# Altium schematic sheet XMOS_TSBOARD_Xmos.SchDoc
size A3; DocumentNumber: 3; SheetNumber: 3; SheetTotal: 8
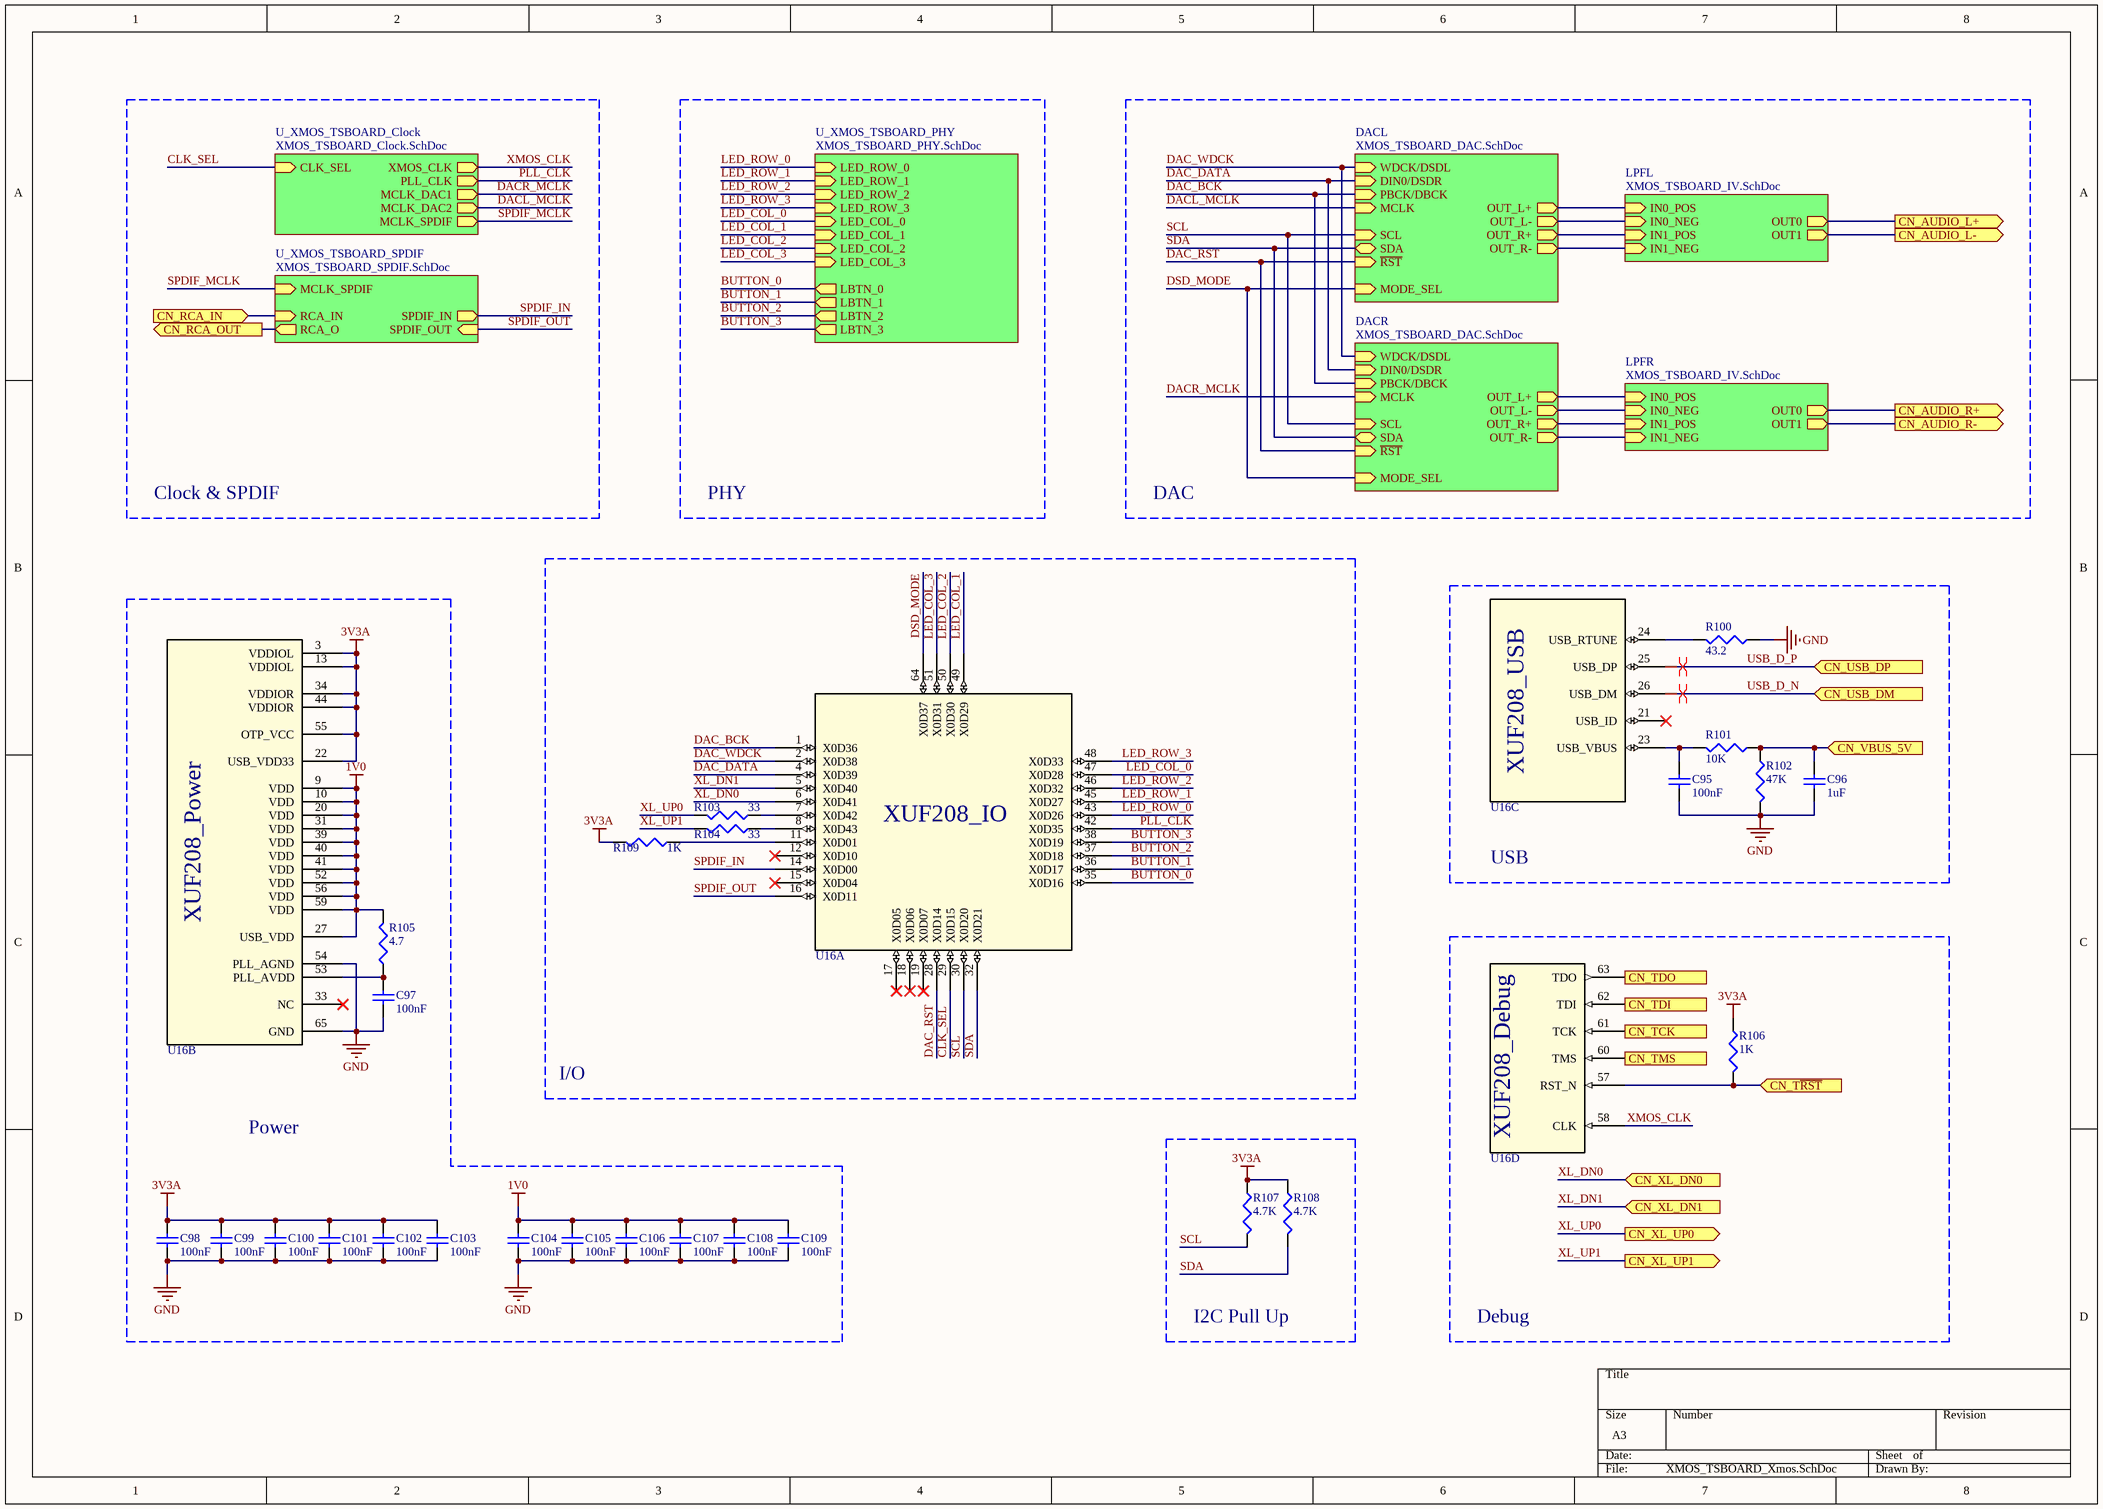
[diagram p0: XMOS_TSBOARD_Xmos.SchDoc]

## Parts
C95  value 100nF  [1608[0603]]  (hidden comment: Cap Semi)
C96  value 1uF  [1608[0603]]  (hidden comment: Cap Semi)
C97  value 100nF  [1608[0603]]  (hidden comment: Cap Semi)
C98  value 100nF  [1608[0603]]  (hidden comment: Cap Semi)
C99  value 100nF  [1608[0603]]  (hidden comment: Cap Semi)
C100  value 100nF  [1608[0603]]  (hidden comment: Cap Semi)
C101  value 100nF  [1608[0603]]  (hidden comment: Cap Semi)
C102  value 100nF  [1608[0603]]  (hidden comment: Cap Semi)
C103  value 100nF  [1608[0603]]  (hidden comment: Cap Semi)
C104  value 100nF  [1608[0603]]  (hidden comment: Cap Semi)
C105  value 100nF  [1608[0603]]  (hidden comment: Cap Semi)
C106  value 100nF  [1608[0603]]  (hidden comment: Cap Semi)
C107  value 100nF  [1608[0603]]  (hidden comment: Cap Semi)
C108  value 100nF  [1608[0603]]  (hidden comment: Cap Semi)
C109  value 100nF  [1608[0603]]  (hidden comment: Cap Semi)
R100  value 43.2  [J1-0603]  (hidden comment: Res3)
R101  value 10K  [J1-0603]  (hidden comment: Res3)
R102  value 47K  [J1-0603]  (hidden comment: Res3)
R103  value 33  [J1-0603]  (hidden comment: Res3)
R104  value 33  [J1-0603]  (hidden comment: Res3)
R105  value 4.7  [J1-0603]  (hidden comment: Res3)
R106  value 1K  [J1-0603]  (hidden comment: Res3)
R107  value 4.7K  [J1-0603]  (hidden comment: Res3)
R108  value 4.7K  [J1-0603]  (hidden comment: Res3)
R109  value 1K  [J1-0603]  (hidden comment: Res3)
U16  XUF208-256-TQ64  [TQFP64]  (value not drawn)  (parts A,B,C,D of 4)

## Blocks framed on the sheet
I/O: R103 R104 R109 U16
Power: C97-C109 R105 U16
USB: C95 C96 R100-R102 U16
Debug: R106 U16
I2C Pull Up: R107 R108

## Sub-sheets
DACL = XMOS_TSBOARD_DAC.SchDoc: MODE_SEL (in), MCLK (in), SCL (in), SDA (bidir), ~{RST} (in), WDCK/DSDL (in), PBCK/DBCK (in), DIN0/DSDR (in), OUT_L- (out), OUT_L+ (out), OUT_R- (out), OUT_R+ (out)
DACR = XMOS_TSBOARD_DAC.SchDoc: MODE_SEL (in), MCLK (in), SCL (in), SDA (bidir), ~{RST} (in), WDCK/DSDL (in), PBCK/DBCK (in), DIN0/DSDR (in), OUT_L- (out), OUT_L+ (out), OUT_R- (out), OUT_R+ (out)
LPFL = XMOS_TSBOARD_IV.SchDoc: IN0_POS (in), IN0_NEG (in), IN1_POS (in), IN1_NEG (in), OUT0 (out), OUT1 (out)
LPFR = XMOS_TSBOARD_IV.SchDoc: IN0_POS (in), IN0_NEG (in), IN1_POS (in), IN1_NEG (in), OUT0 (out), OUT1 (out)
U_XMOS_TSBOARD_Clock = XMOS_TSBOARD_Clock.SchDoc: CLK_SEL (in), XMOS_CLK (out), PLL_CLK (out), MCLK_DAC1 (out), MCLK_DAC2 (out), MCLK_SPDIF (out)
U_XMOS_TSBOARD_PHY = XMOS_TSBOARD_PHY.SchDoc: LED_ROW_0 (in), LED_ROW_1 (in), LED_ROW_2 (in), LED_ROW_3 (in), LED_COL_0 (in), LED_COL_1 (in), LED_COL_2 (in), LED_COL_3 (in), LBTN_0 (out), LBTN_1 (out), LBTN_2 (out), LBTN_3 (out)
U_XMOS_TSBOARD_SPDIF = XMOS_TSBOARD_SPDIF.SchDoc: SPDIF_OUT (in), MCLK_SPDIF (in), RCA_IN (in), RCA_O (out), SPDIF_IN (out)

## Ports
CN_AUDIO_L+ (out), CN_AUDIO_L- (out), CN_AUDIO_R+ (out), CN_AUDIO_R- (out), CN_RCA_IN (in), CN_RCA_OUT (out), CN_TCK (in), CN_TDI (in), CN_TDO (out), CN_TMS (in), CN_T~{RST} (in), CN_USB_DM (in), CN_USB_DP (in), CN_VBUS_5V (in), CN_XL_DN0 (in), CN_XL_DN1 (in), CN_XL_UP0 (out), CN_XL_UP1 (out)

## Nets
1V0: C104.2 C105.2 C106.2 C107.2 C108.2 C109.2 R105.2 U16.9(VDD) U16.10(VDD) U16.20(VDD) U16.27(USB_VDD) U16.31(VDD) U16.39(VDD) U16.40(VDD) U16.41(VDD) U16.52(VDD) U16.56(VDD) U16.59(VDD)
3V3A: C98.2 C99.2 C100.2 C101.2 C102.2 C103.2 R106.1 R107.1 R108.1 R109.2 U16.3(VDDIOL) U16.13(VDDIOL) U16.22(USB_VDD33) U16.34(VDDIOR) U16.44(VDDIOR) U16.55(OTP_VCC)
GND: C95.1 C96.1 C97.1 C98.1 C99.1 C100.1 C101.1 C102.1 C103.1 C104.1 C105.1 C106.1 C107.1 C108.1 C109.1 R100.1 R102.2 U16.54(PLL_AGND) U16.65(GND)
BUTTON_0: U16.35(X0D16) ; sheet U_XMOS_TSBOARD_PHY/LBTN_0
BUTTON_1: U16.36(X0D17) ; sheet U_XMOS_TSBOARD_PHY/LBTN_1
BUTTON_2: U16.37(X0D18) ; sheet U_XMOS_TSBOARD_PHY/LBTN_2
BUTTON_3: U16.38(X0D19) ; sheet U_XMOS_TSBOARD_PHY/LBTN_3
CLK_SEL: U16.29(X0D15) ; sheet U_XMOS_TSBOARD_Clock/CLK_SEL
CN_AUDIO_L+: port CN_AUDIO_L+, sheet LPFL/OUT0
CN_AUDIO_L-: port CN_AUDIO_L-, sheet LPFL/OUT1
CN_AUDIO_R+: port CN_AUDIO_R+, sheet LPFR/OUT0
CN_AUDIO_R-: port CN_AUDIO_R-, sheet LPFR/OUT1
CN_RCA_IN: port CN_RCA_IN, sheet U_XMOS_TSBOARD_SPDIF/RCA_IN
CN_RCA_OUT: port CN_RCA_OUT, sheet U_XMOS_TSBOARD_SPDIF/RCA_O
CN_TCK: U16.61(TCK) ; port CN_TCK
CN_TDI: U16.62(TDI) ; port CN_TDI
CN_TDO: U16.63(TDO) ; port CN_TDO
CN_TMS: U16.60(TMS) ; port CN_TMS
CN_T~{RST}: R106.2 U16.57(RST_N) ; port CN_T~{RST}
CN_VBUS_5V: C96.2 R101.1 R102.1 ; port CN_VBUS_5V
DAC_BCK: U16.1(X0D36) ; sheet DACR/PBCK/DBCK, sheet DACL/PBCK/DBCK
DAC_DATA: U16.4(X0D39) ; sheet DACR/DIN0/DSDR, sheet DACL/DIN0/DSDR
DAC_RST: U16.28(X0D14) ; sheet DACR/~{RST}, sheet DACL/~{RST}
DAC_WDCK: U16.2(X0D38) ; sheet DACR/WDCK/DSDL, sheet DACL/WDCK/DSDL
DACL_MCLK: sheet DACL/MCLK, sheet U_XMOS_TSBOARD_Clock/MCLK_DAC2
DACR_MCLK: sheet DACR/MCLK, sheet U_XMOS_TSBOARD_Clock/MCLK_DAC1
DSD_MODE: U16.64(X0D37) ; sheet DACR/MODE_SEL, sheet DACL/MODE_SEL
LED_COL_0: U16.47(X0D28) ; sheet U_XMOS_TSBOARD_PHY/LED_COL_0
LED_COL_1: U16.49(X0D29) ; sheet U_XMOS_TSBOARD_PHY/LED_COL_1
LED_COL_2: U16.50(X0D30) ; sheet U_XMOS_TSBOARD_PHY/LED_COL_2
LED_COL_3: U16.51(X0D31) ; sheet U_XMOS_TSBOARD_PHY/LED_COL_3
LED_ROW_0: U16.43(X0D26) ; sheet U_XMOS_TSBOARD_PHY/LED_ROW_0
LED_ROW_1: U16.45(X0D27) ; sheet U_XMOS_TSBOARD_PHY/LED_ROW_1
LED_ROW_2: U16.46(X0D32) ; sheet U_XMOS_TSBOARD_PHY/LED_ROW_2
LED_ROW_3: U16.48(X0D33) ; sheet U_XMOS_TSBOARD_PHY/LED_ROW_3
PLL_CLK: U16.42(X0D35) ; sheet U_XMOS_TSBOARD_Clock/PLL_CLK
SCL: R107.2 U16.30(X0D20) ; sheet DACR/SCL, sheet DACL/SCL
SDA: R108.2 U16.32(X0D21) ; sheet DACR/SDA, sheet DACL/SDA
SPDIF_IN: U16.14(X0D00) ; sheet U_XMOS_TSBOARD_SPDIF/SPDIF_IN
SPDIF_MCLK: sheet U_XMOS_TSBOARD_SPDIF/MCLK_SPDIF, sheet U_XMOS_TSBOARD_Clock/MCLK_SPDIF
SPDIF_OUT: U16.16(X0D11) ; sheet U_XMOS_TSBOARD_SPDIF/SPDIF_OUT
USB_D_N: U16.26(USB_DM) ; port CN_USB_DM
USB_D_P: U16.25(USB_DP) ; port CN_USB_DP
XL_DN0: U16.6(X0D41) ; port CN_XL_DN0
XL_DN1: U16.5(X0D40) ; port CN_XL_DN1
XL_UP0: R103.2 ; port CN_XL_UP0
XL_UP1: R104.2 ; port CN_XL_UP1
XMOS_CLK: U16.58(CLK) ; sheet U_XMOS_TSBOARD_Clock/XMOS_CLK
NetC95_2: C95.2 R101.2 U16.23(USB_VBUS)
NetC97_2: C97.2 R105.1 U16.53(PLL_AVDD)
NetR100_2: R100.2 U16.24(USB_RTUNE)
NetR103_1: R103.1 U16.7(X0D42)
NetR104_1: R104.1 U16.8(X0D43)
NetR109_1: R109.1 U16.11(X0D01)
(unnamed): sheet DACR/OUT_L-, sheet LPFR/IN0_NEG
(unnamed): sheet DACR/OUT_L+, sheet LPFR/IN0_POS
(unnamed): sheet DACR/OUT_R-, sheet LPFR/IN1_NEG
(unnamed): sheet DACR/OUT_R+, sheet LPFR/IN1_POS
(unnamed): sheet DACL/OUT_L-, sheet LPFL/IN0_NEG
(unnamed): sheet DACL/OUT_L+, sheet LPFL/IN0_POS
(unnamed): sheet DACL/OUT_R-, sheet LPFL/IN1_NEG
(unnamed): sheet DACL/OUT_R+, sheet LPFL/IN1_POS

Not connected (* = marked no-connect by the designer): U16 12(X0D10)* 15(X0D04)* 17(X0D05)* 18(X0D06)* 19(X0D07)* 21(USB_ID)* 33(NC)*

## Layout directives
differential pair: USB_D_N, USB_D_P

## Notes on the sheet
- Clock & SPDIF
- PHY
- DAC
- (in symbol XUF208-256-TQ64, part A) XUF208_IO
- (in symbol XUF208-256-TQ64, part B) XUF208_Power
- (in symbol XUF208-256-TQ64, part C) XUF208_USB
- (in symbol XUF208-256-TQ64, part D) XUF208_Debug

## Library data of the parts
C95-C109 = Cap Semi: Capacitor (Semiconductor SIM Model); Published: 8-Jun-2000; LatestRevisionDate: 29-May-2009; LatestRevisionNote: IPC-7351 Footprint Added.; PackageReference: C1206; Publisher: Altium Limited; PackageDescription: Chip Capacitor
R100-R109 = Res3: Resistor; Published: 8-Jun-2000; LatestRevisionDate: 29-May-2009; LatestRevisionNote: IPC-7351 Footprint Added.; PackageReference: J1-0603; Publisher: Altium Limited; PackageDescription: Chip Resistor
U16 = XUF208-256-TQ64: xCORE Multicore Microcontrollers